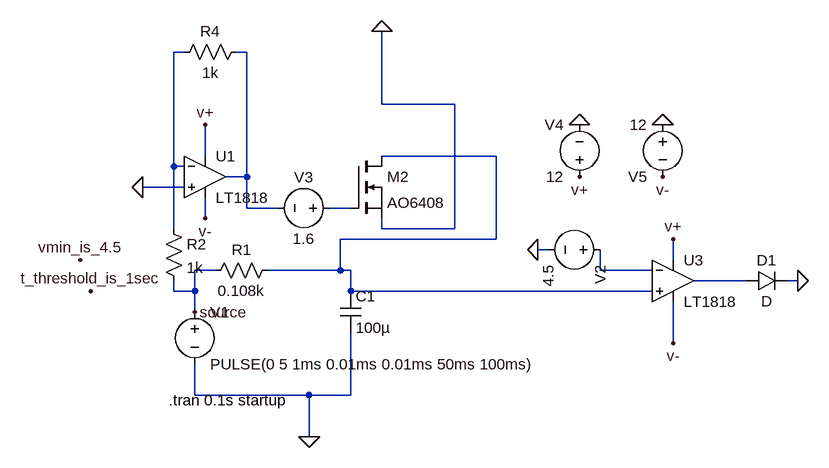
[diagram p0: schematic pulse_detector.asc]
pulse_detector.asc, the LTspice schematic file:
Version 4.1
SHEET 1 1540 680
WIRE 48 -256 32 -256
WIRE 144 -256 128 -256
WIRE 352 -176 352 -288
WIRE 464 -176 352 -176
WIRE 80 -96 80 -144
WIRE 528 -96 352 -96
WIRE 32 -80 32 -256
WIRE 48 -80 32 -80
WIRE 144 -64 144 -256
WIRE 144 -64 112 -64
WIRE 48 -48 -16 -48
WIRE 144 -16 144 -64
WIRE 192 -16 144 -16
WIRE 304 -16 272 -16
WIRE 80 0 80 -32
WIRE 32 16 32 -80
WIRE 352 16 352 0
WIRE 464 16 464 -176
WIRE 464 16 352 16
WIRE 528 32 528 -96
WIRE 528 32 288 32
WIRE 608 48 592 48
WIRE 800 64 800 32
WIRE 96 80 64 80
WIRE 288 80 288 32
WIRE 288 80 176 80
WIRE 304 80 288 80
WIRE 688 80 688 48
WIRE 768 80 688 80
WIRE 912 96 832 96
WIRE 992 96 976 96
WIRE 32 112 32 96
WIRE 64 112 64 80
WIRE 64 112 32 112
WIRE 304 112 304 80
WIRE 768 112 304 112
WIRE 64 144 64 112
WIRE 800 192 800 128
WIRE 64 272 64 224
WIRE 240 272 64 272
WIRE 304 272 304 176
WIRE 304 272 240 272
WIRE 240 336 240 272
FLAG 240 336 0
FLAG -112 64 vmin_is_4.5
FLAG -96 112 t_threshold_is_1sec
FLAG 656 -144 0
FLAG 784 -144 0
FLAG 592 48 0
FLAG 992 96 0
FLAG 64 144 source
FLAG 352 -288 0
FLAG -16 -48 0
FLAG 656 -64 v+
FLAG 784 -64 v-
FLAG 800 192 v-
FLAG 80 0 v-
FLAG 80 -144 v+
FLAG 800 32 v+
SYMBOL voltage 64 128 R0
WINDOW 123 0 0 Left 0
WINDOW 39 0 0 Left 0
SYMATTR InstName V1
SYMATTR Value PULSE(0 5 1ms 0.01ms 0.01ms 50ms 100ms)
SYMBOL cap 288 112 R0
SYMATTR InstName C1
SYMATTR Value 100µ
SYMBOL voltage 704 48 R90
WINDOW 123 0 0 Left 0
WINDOW 39 0 0 Left 0
SYMATTR InstName V2
SYMATTR Value 4.5
SYMBOL voltage 656 -48 R180
WINDOW 0 24 96 Left 2
WINDOW 3 24 16 Left 2
WINDOW 123 0 0 Left 0
WINDOW 39 0 0 Left 0
SYMATTR InstName V4
SYMATTR Value 12
SYMBOL voltage 784 -160 M0
WINDOW 0 24 96 Left 2
WINDOW 3 24 16 Left 2
WINDOW 123 0 0 Left 0
WINDOW 39 0 0 Left 0
SYMATTR InstName V5
SYMATTR Value 12
SYMBOL diode 912 112 R270
WINDOW 0 32 32 VTop 2
WINDOW 3 0 32 VBottom 2
SYMATTR InstName D1
SYMBOL res 192 64 R90
WINDOW 0 0 56 VBottom 2
WINDOW 3 32 56 VTop 2
SYMATTR InstName R1
SYMATTR Value 0.108k
SYMBOL res 16 0 R0
SYMATTR InstName R2
SYMATTR Value 1k
SYMBOL res 144 -272 R90
WINDOW 0 0 56 VBottom 2
WINDOW 3 32 56 VTop 2
SYMATTR InstName R4
SYMATTR Value 1k
SYMBOL voltage 288 -16 R90
WINDOW 0 -32 56 VBottom 2
WINDOW 3 32 56 VTop 2
WINDOW 123 0 0 Left 0
WINDOW 39 0 0 Left 0
SYMATTR InstName V3
SYMATTR Value 1.6
SYMBOL OpAmps\\LT1818 800 96 R0
SYMATTR InstName U3
SYMBOL OpAmps\\LT1818 80 -64 R0
SYMATTR InstName U1
SYMBOL nmos 304 -96 R0
SYMATTR InstName M2
SYMATTR Value AO6408
TEXT 24 280 Left 2 !.tran 0.1s startup

The netlist it stands for:
* pulse_detector.asc
V1 source 0 PULSE(0 5 1ms 0.01ms 0.01ms 50ms 100ms)
C1 N003 0 100µ
V2 N005 0 4.5
V4 v+ 0 12
V5 0 v- 12
D1 N006 0 D
R1 N003 source 0.108k
R2 N001 source 1k
R4 N002 N001 1k
V3 N004 N002 1.6
X§U3 N003 N005 N006 v+ v- LT1818  ; pins In+ In- OUT V+ V-
X§U1 0 N001 N002 v+ v- LT1818  ; pins In+ In- OUT V+ V-
M2 N003 N004 0 0 AO6408
.model D D
.lib standard.dio
.model NMOS NMOS
.model PMOS PMOS
.lib standard.mos
.tran 0.1s startup
.lib LTC2.lib
.backanno
.end